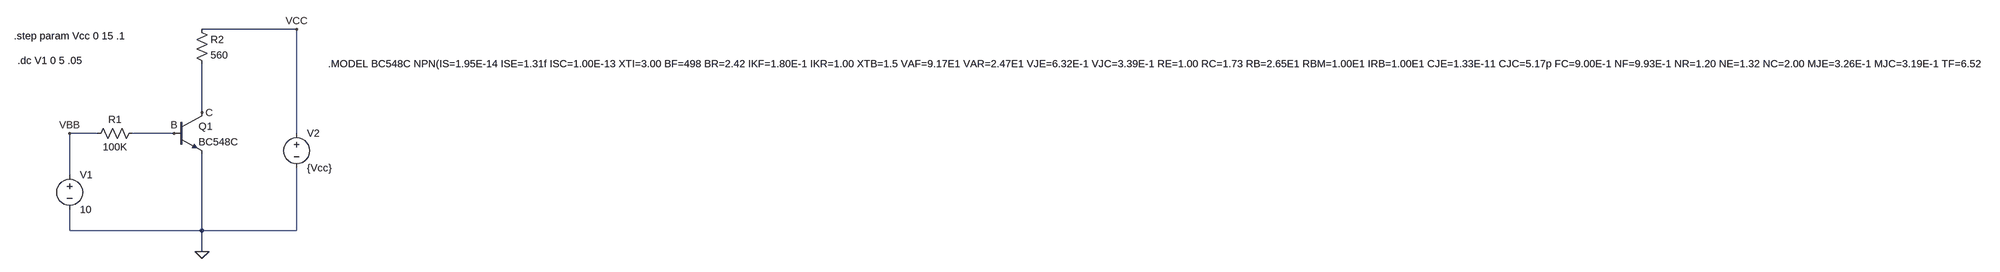
[diagram p0: schematic Beta.asc]
Beta.asc, the LTspice schematic file:
Version 4.1
SHEET 1 5932 680
WIRE 640 -224 416 -224
WIRE 416 -32 416 -144
WIRE 176 16 112 16
WIRE 352 16 256 16
WIRE 640 16 640 -224
WIRE 112 112 112 16
WIRE 112 240 112 192
WIRE 416 240 416 64
WIRE 416 240 112 240
WIRE 640 240 640 96
WIRE 640 240 416 240
WIRE 416 288 416 240
FLAG 416 288 0
FLAG 352 16 B
FLAG 416 -32 C
FLAG 640 -224 VCC
FLAG 112 16 VBB
SYMBOL voltage 112 96 R0
SYMATTR InstName V1
SYMATTR Value 10
SYMBOL res 272 0 R90
WINDOW 0 0 56 VBottom 2
WINDOW 3 32 56 VTop 2
SYMATTR InstName R1
SYMATTR Value 100K
SYMBOL npn 352 -32 R0
SYMATTR InstName Q1
SYMATTR Value BC548C
SYMBOL res 400 -240 R0
SYMATTR InstName R2
SYMATTR Value 560
SYMBOL voltage 640 0 R0
SYMATTR InstName V2
SYMATTR Value {Vcc}
TEXT -16 -208 Left 2 !.step param Vcc 0 15 .1
TEXT -8 -152 Left 2 !.dc V1 0 5 .05
TEXT 712 -144 Left 2 !.MODEL BC548C NPN(IS=1.95E-14 ISE=1.31f ISC=1.00E-13 XTI=3.00 BF=498 BR=2.42 IKF=1.80E-1 IKR=1.00 XTB=1.5 VAF=9.17E1 VAR=2.47E1 VJE=6.32E-1 VJC=3.39E-1 RE=1.00 RC=1.73 RB=2.65E1 RBM=1.00E1 IRB=1.00E1 CJE=1.33E-11 CJC=5.17p FC=9.00E-1 NF=9.93E-1 NR=1.20 NE=1.32 NC=2.00 MJE=3.26E-1 MJC=3.19E-1 TF=6.52E-10 TR=0 ITF=1.03 VTF=1.65 XTF=1.00E2 EG=1.11 VCEO=30 ICRATING=100m MFG=PHILIPS)

The netlist it stands for:
* Beta.asc
V1 VBB 0 10
R1 B VBB 100K
Q1 C B 0 0 BC548C
R2 VCC C 560
V2 VCC 0 {Vcc}
.model NPN NPN
.model PNP PNP
.lib standard.bjt
.step param Vcc 0 15 .1
.dc V1 0 5 .05
.MODEL BC548C NPN(IS=1.95E-14 ISE=1.31f ISC=1.00E-13 XTI=3.00 BF=498 BR=2.42 IKF=1.80E-1 IKR=1.00 XTB=1.5 VAF=9.17E1 VAR=2.47E1 VJE=6.32E-1 VJC=3.39E-1 RE=1.00 RC=1.73 RB=2.65E1 RBM=1.00E1 IRB=1.00E1 CJE=1.33E-11 CJC=5.17p FC=9.00E-1 NF=9.93E-1 NR=1.20 NE=1.32 NC=2.00 MJE=3.26E-1 MJC=3.19E-1 TF=6.52E-10 TR=0 ITF=1.03 VTF=1.65 XTF=1.00E2 EG=1.11 VCEO=30 ICRATING=100m MFG=PHILIPS)
.backanno
.end